# Altium project IDCI_WifiNode_R00.PrjPcb
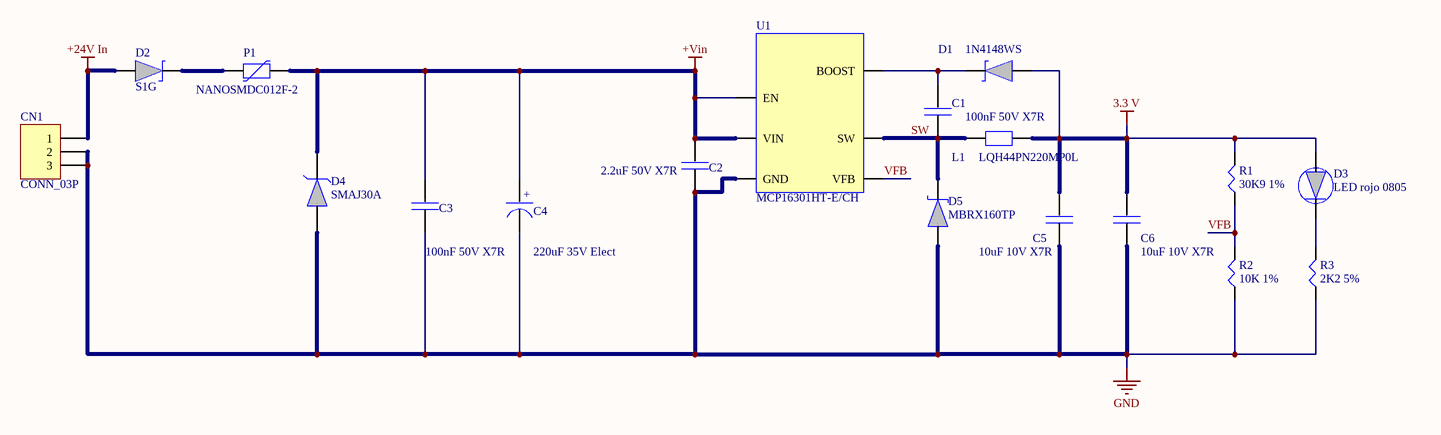
[diagram p0: IDCI_WifiNode_PWR.SchDoc]
4 sheets, 66 parts. Net scope: flat (ports and power ports of the same name join across sheets).
Sheets:
  IDCI_WifiNode_PWR.SchDoc
  IDCI_WifiNode_CPU0.SchDoc
  IDCI_WifiNode_CPU1.SchDoc
  IDCI_WifiNode_PER.SchDoc

## Sheet IDCI_WifiNode_PWR.SchDoc: WifiNoder_PWR
size A4; Author: Luciano Lopez; CompanyName: UTN-FRBA; Revision: 1; SheetNumber: 2; SheetTotal: 5

### Parts
C1  100nF 50V X7R
C2  2.2uF 50V X7R
C3  100nF 50V X7R
C4  220uF 35V Elect
C5  10uF 10V X7R
C6  10uF 10V X7R
CN1  CONN_03P
D1  1N4148WS
D2  S1G
D3  LED rojo 0805
D4  SMAJ30A
D5  MBRX160TP
L1  LQH44PN220MP0L
P1  NANOSMDC012F-2
R1  30K9 1%
R2  10K 1%
R3  2K2 5%
U1  MCP16301HT-E/CH

### Nets
3.3 V: C5.39 C6.39 D1.34 D3.31 L1.46 R1.48
+24V In: CN1.1 D2.34
+Vin: C2.39 C3.39 C4.36 D4.33 P1.40 U1.49(EN) U1.50(VIN)
GND: C2.38 C3.38 C4.37 C5.38 C6.38 CN1.2 CN1.3 D4.32 D5.34 R2.47 R3.47 U1.51(GND)
SW: C1.38 D5.35 L1.45 U1.52(SW)
VFB: R1.47 R2.48 U1.54(VFB)
NetC1_39: C1.39 D1.35 U1.53(BOOST)
NetD2_35: D2.35 P1.41
NetD3_30: D3.30 R3.48

### Notes on the sheet
- Title:
- Size:
- Author:
- A4
- Sheet
- of
- Revision:
- File:
- Date:
- (in symbol POL_CAP) +

### Library data of the parts
C1-C3 C5 C6 = Capacitor: 100nF x 50v
C4 = POL_CAP: Capacitor polarizado
CN1 = CONN_03P: Connector Generic 3 Vias
D1 D2 D5 = TVS_DIODE
D3 = LED_DIODE
D4 = ZENER_DIODE
L1 = Inductor
P1 = Polyswitch
R1-R3 = Resistor
U1 = Integrado: Driver Switching

## Sheet IDCI_WifiNode_CPU0.SchDoc: WifiNode_CPU0
size A4; Author: Luciano Lopez; CompanyName: UTN - FRBA; Revision: 1; SheetNumber: 3; SheetTotal: 5
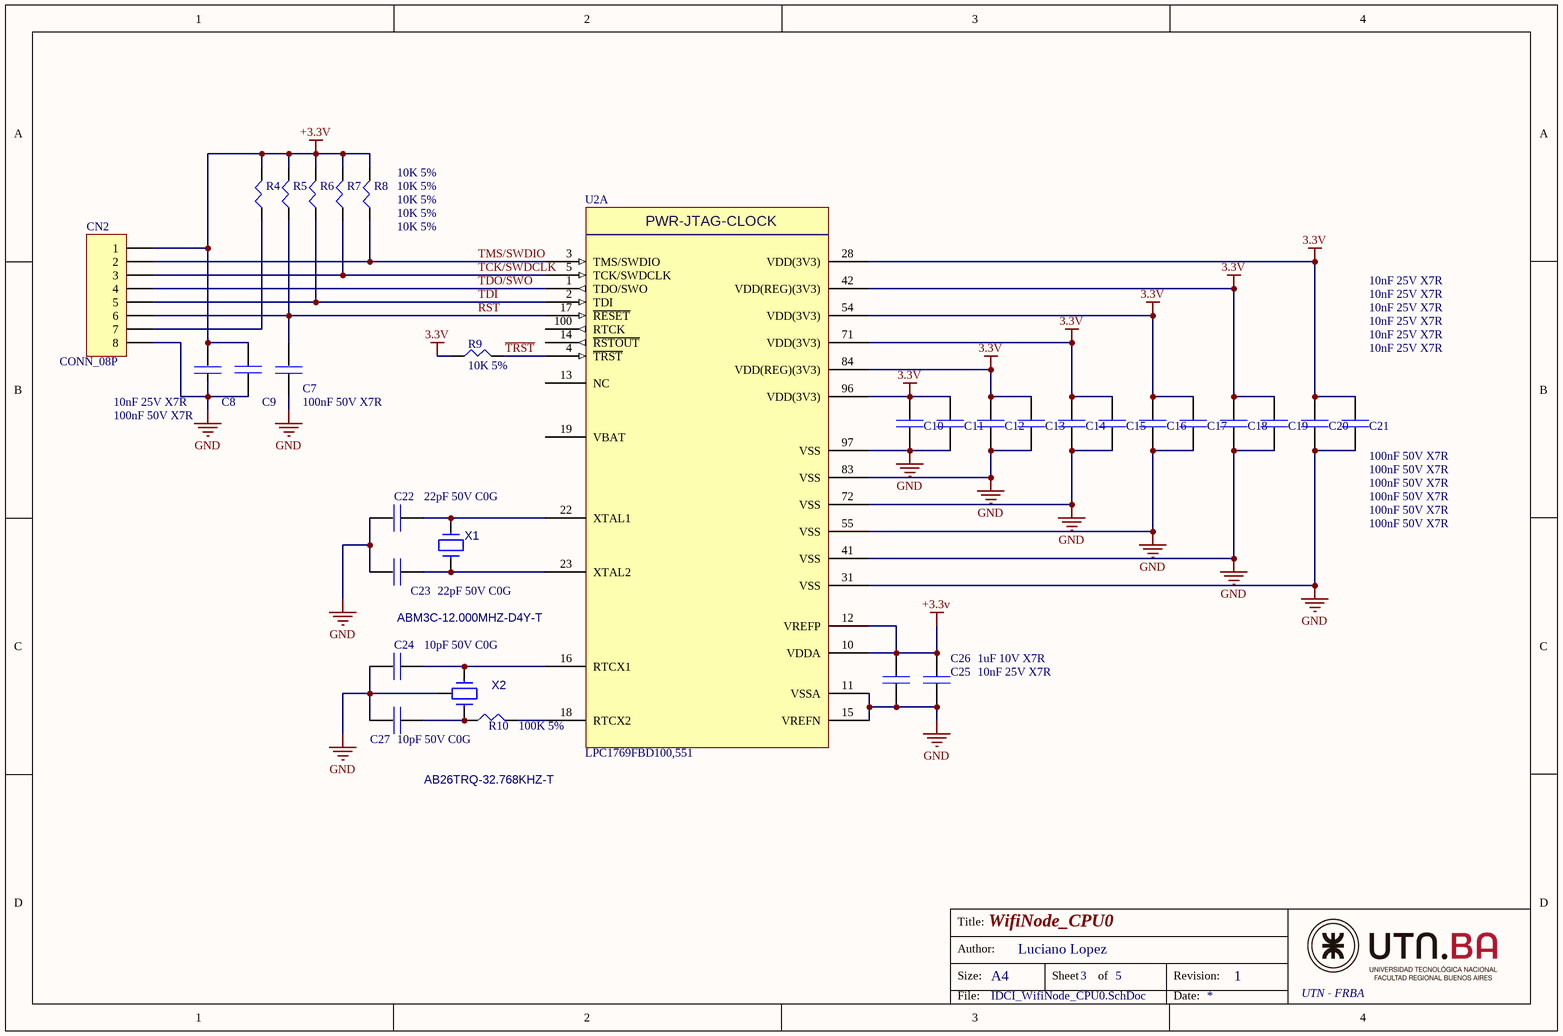
[diagram p1: IDCI_WifiNode_CPU0.SchDoc]

### Parts
C7  100nF 50V X7R  [C_0805]
C8  10nF 25V X7R  [C_0805]
C9  100nF 50V X7R  [C_0805]
C10  100nF 50V X7R  [C_0805]
C11  10nF 25V X7R  [C_0805]
C12  100nF 50V X7R  [C_0805]
C13  10nF 25V X7R  [C_0805]
C14  100nF 50V X7R  [C_0805]
C15  10nF 25V X7R  [C_0805]
C16  100nF 50V X7R  [C_0805]
C17  10nF 25V X7R  [C_0805]
C18  100nF 50V X7R  [C_0805]
C19  10nF 25V X7R  [C_0805]
C20  100nF 50V X7R  [C_0805]
C21  10nF 25V X7R  [C_0805]
C22  22pF 50V C0G  [C_0805]
C23  22pF 50V C0G  [C_0805]
C24  10pF 50V C0G  [C_0805]
C25  10nF 25V X7R  [C_0805]
C26  1uF 10V X7R  [C_0805]
C27  10pF 50V C0G  [C_0805]
CN2  CONN_08P  [HEADER_M_1x8_0.1"]
R4  10K 5%  [R_0805]
R5  10K 5%  [R_0805]
R6  10K 5%  [R_0805]
R7  10K 5%  [R_0805]
R8  10K 5%  [R_0805]
R9  10K 5%  [R_0805]
R10  100K 5%  [R_0805]
U2  LPC1769FBD100,551  [LQFP_100]  (part A of 4)
X1  ABM3C-12.000MHZ-D4Y-T  [CRYSTAL_12MHZ]
X2  AB26TRQ-32.768KHZ-T  [CRYSTA_32.768KHZ]

### Nets
3.3V: C10.2 C11.2 C12.2 C13.2 C14.2 C15.2 C16.2 C17.2 C18.2 C19.2 C20.2 C21.2 R9.1 U2.28(VDD(3V3)) U2.42(VDD(REG)(3V3)) U2.54(VDD(3V3)) U2.71(VDD(3V3)) U2.84(VDD(REG)(3V3)) U2.96(VDD(3V3))
+3.3V: C8.1 C9.2 C25.2 C26.2 CN2.1 R4.2 R5.2 R6.2 R7.2 R8.2 U2.10(VDDA) U2.12(VREFP)
GND: C7.2 C8.2 C9.1 C10.1 C11.1 C12.1 C13.1 C14.1 C15.1 C16.1 C17.1 C18.1 C19.1 C20.1 C21.1 C22.2 C23.2 C24.2 C25.1 C26.1 C27.2 CN2.8 U2.11(VSSA) U2.15(VREFN) U2.31(VSS) U2.41(VSS) U2.55(VSS) U2.72(VSS) U2.83(VSS) U2.97(VSS) X2.2
~{TRST}: R9.2 U2.4(~{TRST})
RST: C7.1 CN2.6 R5.1 U2.17(~{RESET})
TCK/SWDCLK: CN2.3 R7.1 U2.5(TCK/SWDCLK)
TDI: CN2.5 R6.1 U2.2(TDI)
TDO/SWO: CN2.4 U2.1(TDO/SWO)
TMS/SWDIO: CN2.2 R8.1 U2.3(TMS/SWDIO)
NetC22_1: C22.1 U2.22(XTAL1) X1.1
NetC23_1: C23.1 U2.23(XTAL2) X1.3
NetC24_1: C24.1 U2.16(RTCX1) X2.3
NetC27_1: C27.1 R10.1 X2.1
NetCN2_7: CN2.7 R4.1
NetR10_2: R10.2 U2.18(RTCX2)

Not connected (* = marked no-connect by the designer): U2 13(NC) 14(~{RSTOUT}) 19(VBAT) 100(RTCK)

### Notes on the sheet
- Title:
- Size:
- Author:
- A4
- Sheet
- of
- Revision:
- File:
- Date:
- (in symbol LPC1769FBD100_Multipart, part A) PWR-JTAG-CLOCK

### Library data of the parts
C7-C27 = CAPACITOR: 100nF x 50v
CN2 = CONN_08P: Connector Generic 8 Vias
R4-R10 = Resistor
U2 = LPC1769FBD100_Multipart: Mcu Cortex M3 LQFP100
X1 = CRYSTAL_2P: Crystal 2 Vias
X2 = CRYSTAL 3P: Crystal 2 Vias + GND

## Sheet IDCI_WifiNode_CPU1.SchDoc: WifiNode_CPU1
size A4; Author: Luciano Lopez; CompanyName: UTN-FRBA; Revision: 1; SheetNumber: 4; SheetTotal: 5
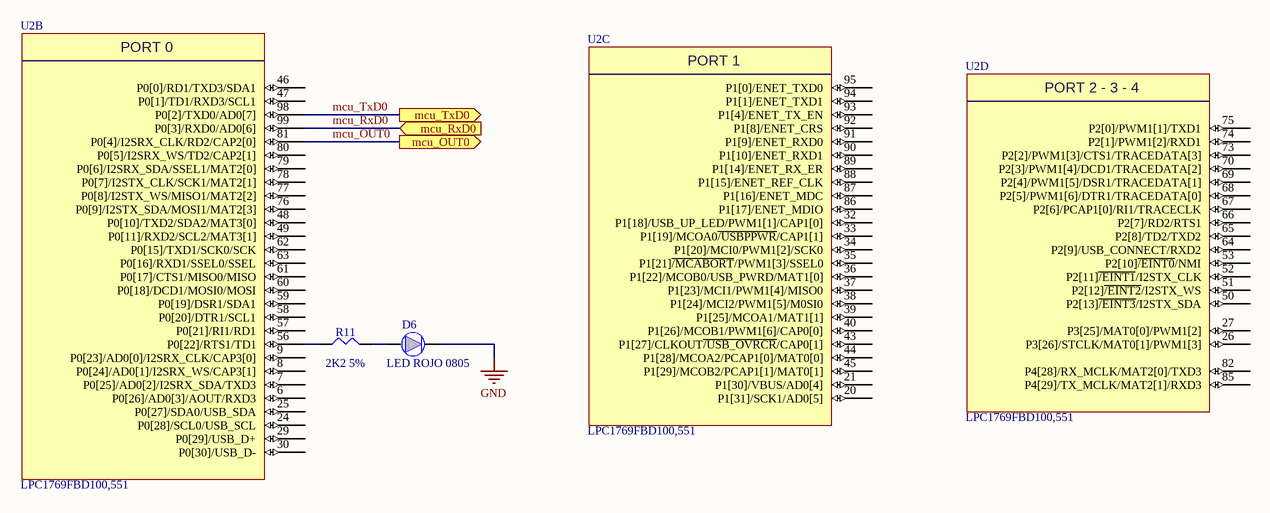
[diagram p2: IDCI_WifiNode_CPU1.SchDoc]

### Parts
D6  LED ROJO 0805  [LED_0805]
R11  2K2 5%  [R_0805]
U2  LPC1769FBD100,551  [LQFP_100]  (parts B,C,D of 4)

### Ports
mcu_OUT0 (out), mcu_RxD0 (in), mcu_TxD0 (out)

### Nets
GND: D6.2
mcu_OUT0: U2.81(P0[4]/I2SRX_CLK/RD2/CAP2[0]) ; port mcu_OUT0
mcu_RxD0: U2.99(P0[3]/RXD0/AD0[6]) ; port mcu_RxD0
mcu_TxD0: U2.98(P0[2]/TXD0/AD0[7]) ; port mcu_TxD0
NetD6_1: D6.1 R11.2
NetR11_1: R11.1 U2.56(P0[22]/RTS1/TD1)

Not connected (* = marked no-connect by the designer): U2 6(P0[26]/AD0[3]/AOUT/RXD3) 7(P0[25]/AD0[2]/I2SRX_SDA/TXD3) 8(P0[24]/AD0[1]/I2SRX_WS/CAP3[1]) 9(P0[23]/AD0[0]/I2SRX_CLK/CAP3[0]) 20(P1[31]/SCK1/AD0[5]) 21(P1[30]/VBUS/AD0[4]) 24(P0[28]/SCL0/USB_SCL) 25(P0[27]/SDA0/USB_SDA) 26(P3[26]/STCLK/MAT0[1]/PWM1[3]) 27(P3[25]/MAT0[0]/PWM1[2]) 29(P0[29]/USB_D+) 30(P0[30]/USB_D-) 32(P1[18]/USB_UP_LED/PWM1[1]/CAP1[0]) 33(P1[19]/MCOA0~{/USBPPWR}/CAP1[1]) 34(P1[20]/MCI0/PWM1[2]/SCK0) 35(P1[21]~{/MCABORT}/PWM1[3]/SSEL0) 36(P1[22]/MCOB0/USB_PWRD/MAT1[0]) 37(P1[23]/MCI1/PWM1[4]/MISO0) 38(P1[24]/MCI2/PWM1[5]/M0SI0) 39(P1[25]/MCOA1/MAT1[1]) 40(P1[26]/MCOB1/PWM1[6]/CAP0[0]) 43(P1[27]/CLKOUT~{/USB_OVRCR}/CAP0[1]) 44(P1[28]/MCOA2/PCAP1[0]/MAT0[0]) 45(P1[29]/MCOB2/PCAP1[1]/MAT0[1]) 46(P0[0]/RD1/TXD3/SDA1) 47(P0[1]/TD1/RXD3/SCL1) 48(P0[10]/TXD2/SDA2/MAT3[0]) 49(P0[11]/RXD2/SCL2/MAT3[1]) 50(P2[13]~{/EINT3}/I2STX_SDA) 51(P2[12]~{/EINT2}/I2STX_WS) 52(P2[11]~{/EINT1}/I2STX_CLK) 53(P2[10]~{/EINT0}/NMI) 57(P0[21]/RI1/RD1) 58(P0[20]/DTR1/SCL1) 59(P0[19]/DSR1/SDA1) 60(P0[18]/DCD1/MOSI0/MOSI) 61(P0[17]/CTS1/MISO0/MISO) 62(P0[15]/TXD1/SCK0/SCK) 63(P0[16]/RXD1/SSEL0/SSEL) 64(P2[9]/USB_CONNECT/RXD2) 65(P2[8]/TD2/TXD2) 66(P2[7]/RD2/RTS1) 67(P2[6]/PCAP1[0]/RI1/TRACECLK) 68(P2[5]/PWM1[6]/DTR1/TRACEDATA[0]) 69(P2[4]/PWM1[5]/DSR1/TRACEDATA[1]) 70(P2[3]/PWM1[4]/DCD1/TRACEDATA[2]) 73(P2[2]/PWM1[3]/CTS1/TRACEDATA[3]) 74(P2[1]/PWM1[2]/RXD1) 75(P2[0]/PWM1[1]/TXD1) 76(P0[9]/I2STX_SDA/MOSI1/MAT2[3]) 77(P0[8]/I2STX_WS/MISO1/MAT2[2]) 78(P0[7]/I2STX_CLK/SCK1/MAT2[1]) 79(P0[6]/I2SRX_SDA/SSEL1/MAT2[0]) 80(P0[5]/I2SRX_WS/TD2/CAP2[1]) 82(P4[28]/RX_MCLK/MAT2[0]/TXD3) 85(P4[29]/TX_MCLK/MAT2[1]/RXD3) 86(P1[17]/ENET_MDIO) 87(P1[16]/ENET_MDC) 88(P1[15]/ENET_REF_CLK) 89(P1[14]/ENET_RX_ER) 90(P1[10]/ENET_RXD1) 91(P1[9]/ENET_RXD0) 92(P1[8]/ENET_CRS) 93(P1[4]/ENET_TX_EN) 94(P1[1]/ENET_TXD1) 95(P1[0]/ENET_TXD0)

### Notes on the sheet
- Title:
- Size:
- Author:
- A4
- Sheet
- of
- Revision:
- File:
- Date:
- (in symbol LPC1769FBD100_Multipart, part B) PORT 0
- (in symbol LPC1769FBD100_Multipart, part C) PORT 1
- (in symbol LPC1769FBD100_Multipart, part D) PORT 2 - 3 - 4

### Library data of the parts
D6 = LED_DIODE
R11 = Resistor
U2 = LPC1769FBD100_Multipart: Mcu Cortex M3 LQFP100

## Sheet IDCI_WifiNode_PER.SchDoc: WifiNode_PER
size A4; Author: Luciano Lopez; CompanyName: UTN-FRBA; Revision: 1; SheetNumber: 5; SheetTotal: 5
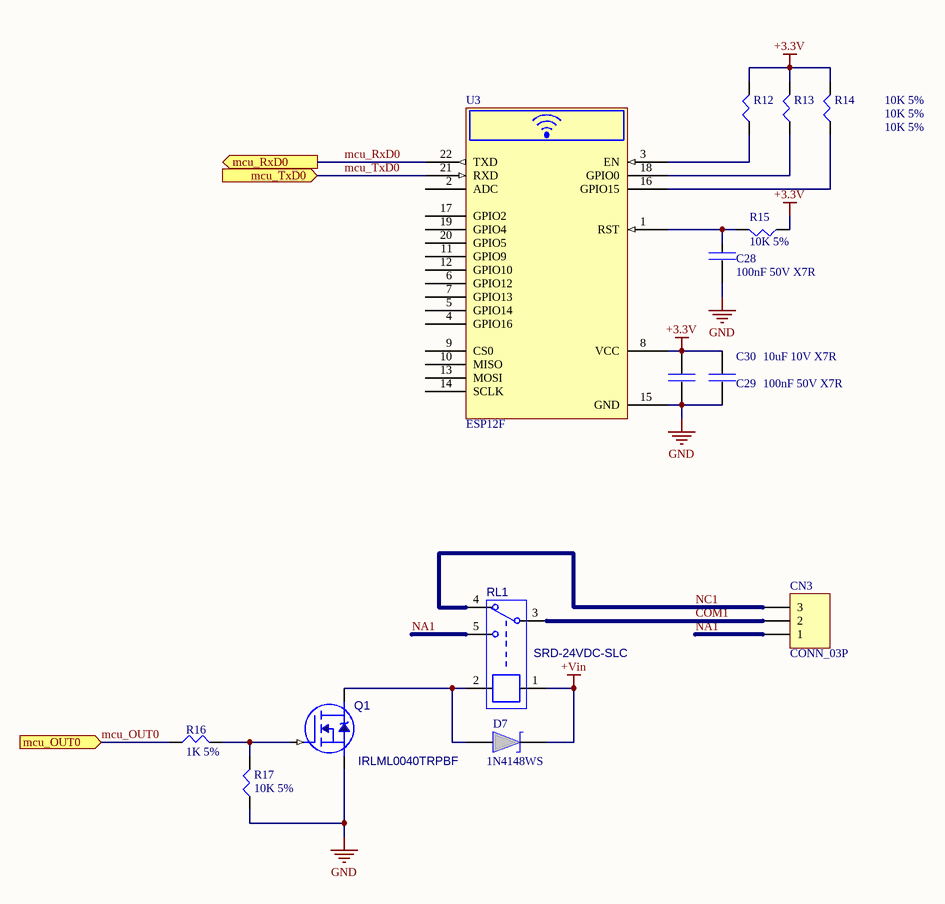
[diagram p3: IDCI_WifiNode_PER.SchDoc]

### Parts
C28  100nF 50V X7R  [C_0805]
C29  100nF 50V X7R  [C_0805]
C30  10uF 10V X7R  [C_0805]
CN3  CONN_03P  [TERMINAL_BLOCK_3_POLES]
D7  1N4148WS  [Diode_SOD-323]
Q1  IRLML0040TRPBF  [IC_SOT-23]
R12  10K 5%  [R_0805]
R13  10K 5%  [R_0805]
R14  10K 5%  [R_0805]
R15  10K 5%  [R_0805]
R16  1K 5%  [R_0805]
R17  10K 5%  [R_0805]
RL1  SRD-24VDC-SLC  [RELAY]
U3  ESP12F  [ESP12F]

### Ports
mcu_OUT0 (in), mcu_RxD0 (out), mcu_TxD0 (in)

### Nets
+3.3V: C29.2 C30.2 R12.2 R13.2 R14.2 R15.1 U3.8(VCC)
+Vin: D7.2 RL1.1
GND: C28.1 C29.1 C30.1 Q1.2(SOURCE) R17.1 U3.15(GND)
COM1: CN3.2 RL1.3
mcu_OUT0: R16.1 ; port mcu_OUT0
mcu_RxD0: U3.22(TXD) ; port mcu_RxD0
mcu_TxD0: U3.21(RXD) ; port mcu_TxD0
NA1: CN3.1 RL1.5
NC1: CN3.3 RL1.4
NetC28_2: C28.2 R15.2 U3.1(RST)
NetD7_1: D7.1 Q1.3(DRAIN) RL1.2
NetQ1_1: Q1.1(GATE) R16.2 R17.2
NetR12_1: R12.1 U3.3(EN)
NetR13_1: R13.1 U3.18(GPIO0)
NetR14_1: R14.1 U3.16(GPIO15)

Not connected (* = marked no-connect by the designer): U3 2(ADC) 4(GPIO16) 5(GPIO14) 6(GPIO12) 7(GPIO13) 9(CS0) 10(MISO) 11(GPIO9) 12(GPIO10) 13(MOSI) 14(SCLK) 17(GPIO2) 19(GPIO4) 20(GPIO5)

### Notes on the sheet
- Title:
- Size:
- Author:
- A4
- Sheet
- of
- Revision:
- File:
- Date:

### Library data of the parts
C28-C30 = CAPACITOR: 100nF x 50v
CN3 = CONN_03P: Connector Generic 3 Vias
D7 = TVS_DIODE
Q1 = N_MOSFET_SOT23: Mosfet N-Ch
R12-R17 = Resistor
RL1 = RELAY SPDT
U3 = ESP12F Wifi Module: Wifi Module

## Nets that join several sheets
+3.3V: IDCI_WifiNode_CPU0 (12 pins), IDCI_WifiNode_PER (7 pins)
+Vin: IDCI_WifiNode_PWR (7 pins), IDCI_WifiNode_PER (D7.2 RL1.1)
GND: IDCI_WifiNode_PWR (12 pins), IDCI_WifiNode_CPU0 (31 pins), IDCI_WifiNode_CPU1 (D6.2), IDCI_WifiNode_PER (6 pins)
mcu_OUT0: IDCI_WifiNode_CPU1 (U2.81), IDCI_WifiNode_PER (R16.1)
mcu_RxD0: IDCI_WifiNode_CPU1 (U2.99), IDCI_WifiNode_PER (U3.22)
mcu_TxD0: IDCI_WifiNode_CPU1 (U2.98), IDCI_WifiNode_PER (U3.21)